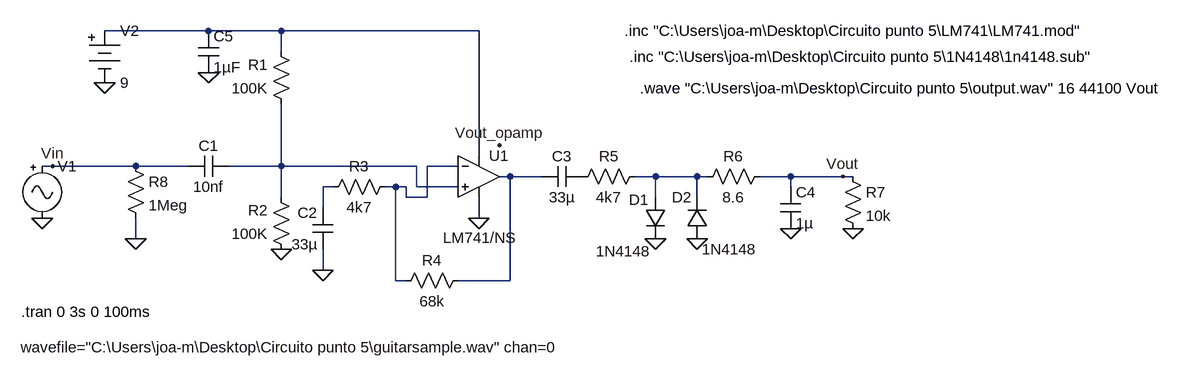
[diagram p0: schematic punto 5.asc]
punto 5.asc, the LTspice schematic file:
Version 4
SHEET 1 1228 680
WIRE -288 -80 -448 -80
WIRE -176 -80 -288 -80
WIRE 128 -80 -176 -80
WIRE -176 -48 -176 -80
WIRE 128 112 128 -80
WIRE -528 128 -544 128
WIRE -400 128 -528 128
WIRE -320 128 -400 128
WIRE -176 128 -176 32
WIRE -176 128 -256 128
WIRE 32 128 -176 128
WIRE 96 128 48 128
WIRE 176 144 160 144
WIRE 224 144 176 144
WIRE 400 144 368 144
WIRE 464 144 400 144
WIRE 480 144 464 144
WIRE 608 144 560 144
WIRE 688 144 608 144
WIRE 704 144 688 144
WIRE -96 160 -112 160
WIRE 0 160 -16 160
WIRE 16 160 0 160
WIRE 32 160 32 128
WIRE 96 160 32 160
WIRE 608 160 608 144
WIRE -176 176 -176 128
WIRE 16 176 16 160
WIRE 48 176 48 128
WIRE 48 176 16 176
WIRE 400 176 400 144
WIRE 464 176 464 144
WIRE -112 192 -112 160
WIRE 128 208 128 176
WIRE -400 240 -400 208
WIRE -112 288 -112 256
WIRE 0 304 0 160
WIRE 16 304 0 304
WIRE 176 304 176 144
WIRE 176 304 96 304
FLAG -112 288 0
FLAG 400 240 0
FLAG 464 240 0
FLAG 608 224 0
FLAG 128 208 0
FLAG -176 256 0
FLAG 704 224 0
FLAG -288 -16 0
FLAG -400 240 0
FLAG -544 208 0
FLAG -448 0 0
FLAG 688 144 Vout
FLAG -528 128 Vin
FLAG 160 96 Vout_opamp
SYMBOL Opamps\\opamp2 128 80 R0
WINDOW 3 -55 158 Left 2
SYMATTR Value LM741/NS
SYMATTR InstName U1
SYMBOL res -160 48 R180
WINDOW 0 36 76 Left 2
WINDOW 3 36 40 Left 2
SYMATTR InstName R1
SYMATTR Value 100K
SYMBOL res -160 272 R180
WINDOW 0 36 76 Left 2
WINDOW 3 36 40 Left 2
SYMATTR InstName R2
SYMATTR Value 100K
SYMBOL res -112 176 R270
WINDOW 0 32 56 VTop 2
WINDOW 3 0 56 VBottom 2
SYMATTR InstName R3
SYMATTR Value 4k7
SYMBOL res 112 288 R90
WINDOW 0 0 56 VBottom 2
WINDOW 3 32 56 VTop 2
SYMATTR InstName R4
SYMATTR Value 68k
SYMBOL res 384 128 R90
WINDOW 0 0 56 VBottom 2
WINDOW 3 32 56 VTop 2
SYMATTR InstName R5
SYMATTR Value 4k7
SYMBOL cap -256 112 R90
WINDOW 0 0 32 VBottom 2
WINDOW 3 32 32 VTop 2
SYMATTR InstName C1
SYMATTR Value 10nf
SYMBOL cap -96 256 R180
WINDOW 0 24 56 Left 2
WINDOW 3 24 8 Left 2
SYMATTR InstName C2
SYMATTR Value 33µ
SYMBOL cap 224 160 R270
WINDOW 0 32 32 VTop 2
WINDOW 3 0 32 VBottom 2
SYMATTR InstName C3
SYMATTR Value 33µ
SYMBOL res 576 128 R90
WINDOW 0 0 56 VBottom 2
WINDOW 3 32 56 VTop 2
SYMATTR InstName R6
SYMATTR Value 8.6
SYMBOL cap 592 160 R0
SYMATTR InstName C4
SYMATTR Value 1µ
SYMBOL diode 384 176 R0
WINDOW 0 -25 4 Left 2
WINDOW 3 87 80 Left 2
SYMATTR InstName D1
SYMATTR Value 1N4148
SYMBOL diode 480 240 R180
WINDOW 0 24 64 Left 2
WINDOW 3 87 -19 Left 2
SYMATTR InstName D2
SYMATTR Value 1N4148
SYMBOL res 688 128 R0
SYMATTR InstName R7
SYMATTR Value 10k
SYMBOL res -416 112 R0
SYMATTR InstName R8
SYMATTR Value 1Meg
SYMBOL cap -304 -80 R0
SYMATTR InstName C5
SYMATTR Value 1µF
SYMBOL Misc\\battery -448 -96 R0
WINDOW 123 0 0 Left 2
WINDOW 39 0 0 Left 2
SYMATTR InstName V2
SYMATTR Value 9
SYMBOL Misc\\signal -544 112 R0
WINDOW 3 -33 295 Left 2
WINDOW 123 0 0 Left 2
WINDOW 39 0 0 Left 2
SYMATTR Value wavefile="C:\Users\joa-m\Desktop\Circuito punto 5\guitarsample.wav" chan=0
SYMATTR InstName V1
TEXT 352 -80 Left 2 !.inc "C:\\Users\\joa-m\\Desktop\\Circuito punto 5\\LM741\\LM741.mod"
TEXT 360 -40 Left 2 !.inc "C:\\Users\\joa-m\\Desktop\\Circuito punto 5\\1N4148\\1n4148.sub"
TEXT -576 352 Left 2 !.tran 0 3s 0 100ms
TEXT 376 8 Left 2 !.wave "C:\\Users\\joa-m\\Desktop\\Circuito punto 5\\output.wav" 16 44100 Vout

The netlist it stands for:
* punto 5.asc
XU1 N002 N003 N001 0 N004 LM741/NS  ; pins In+ In- V+ V- OUT
R1 N002 N001 100K
R2 0 N002 100K
R3 N006 N003 4k7
R4 N004 N003 68k
R5 N005 P001 4k7
C1 N002 Vin 10nf
C2 0 N006 33µ
C3 N004 P001 33µ
R6 Vout N005 8.6
C4 Vout 0 1µ
D1 N005 0 1N4148
D2 0 N005 1N4148
R7 Vout 0 10k
R8 Vin 0 1Meg
C5 N001 0 1µF
V2 N001 0 9
V1 Vin 0 wavefile="C:\Users\joa-m\Desktop\Circuito punto 5\guitarsample.wav" chan=0
.model D D
.lib standard.dio
.inc "C:\Users\joa-m\Desktop\Circuito punto 5\LM741\LM741.mod"
.inc "C:\Users\joa-m\Desktop\Circuito punto 5\1N4148\1n4148.sub"
.tran 0 3s 0 100ms
.wave "C:\Users\joa-m\Desktop\Circuito punto 5\output.wav" 16 44100 Vout
.backanno
.end